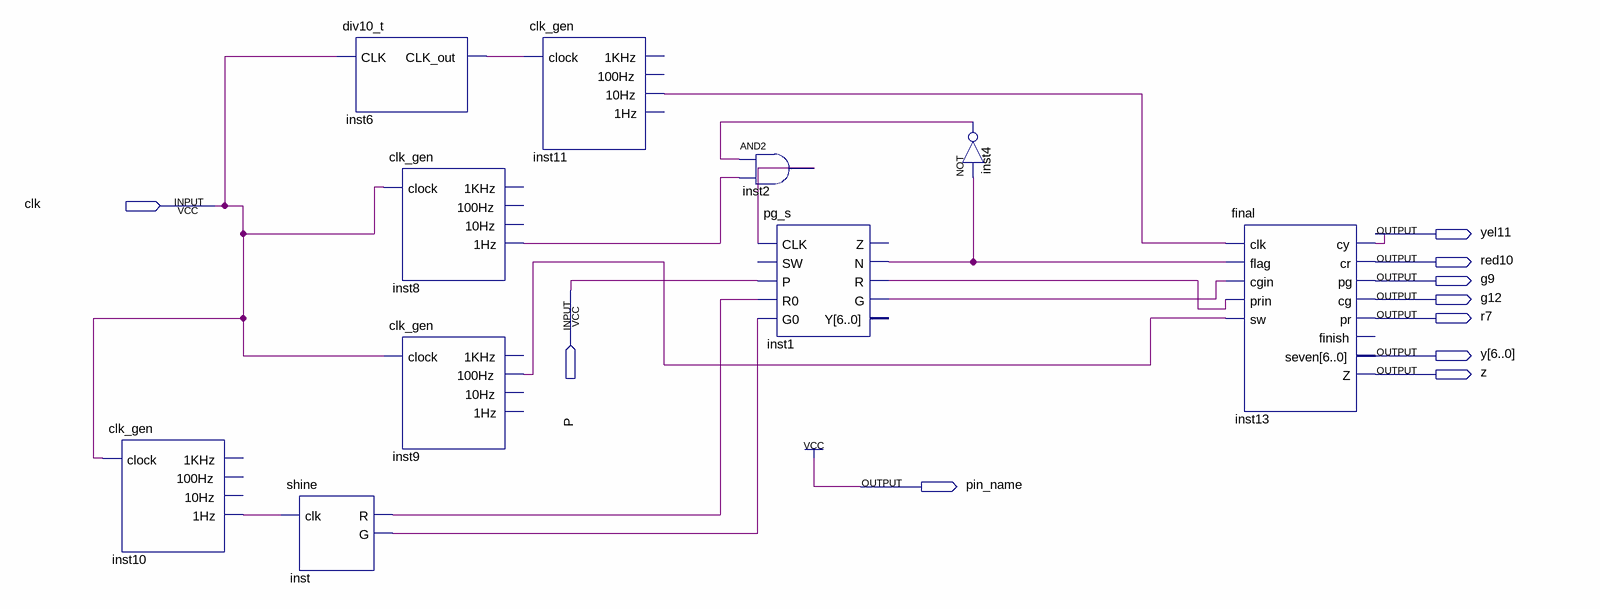
[diagram p0: schematic sheet]
// Quartus schematic fgt.bdf as structural Verilog: 10 symbols, 10 pins
module fgt (
  input  clk,
  input  P,
  output yel11,
  output red10,
  output g9,
  output g12,
  output r7,
  output [6:0] y,
  output z,
  output pin_name
);

  wire inst1_g, inst1_n, inst1_r, inst2_out, inst4_out, inst6_clk_out, inst8_1hz, inst9_100hz, inst10_1hz,
       inst11_10hz, inst_g, inst_r;

  clk_gen inst10 (.clock(clk), .\1Hz (inst10_1hz));  // open: 1KHz, 100Hz, 10Hz
  div10_t inst6 (.CLK(clk), .CLK_out(inst6_clk_out));
  shine inst (.clk(inst10_1hz), .R(inst_r), .G(inst_g));
  clk_gen inst8 (.clock(clk), .\1Hz (inst8_1hz));  // open: 1KHz, 100Hz, 10Hz
  clk_gen inst9 (.clock(clk), .\100Hz (inst9_100hz));  // open: 1KHz, 10Hz, 1Hz
  clk_gen inst11 (.clock(inst6_clk_out), .\10Hz (inst11_10hz));  // open: 1KHz, 100Hz, 1Hz
  and inst2 (inst2_out, inst4_out, inst8_1hz);
  pg_s inst1 (
    .CLK(inst2_out), .P(P), .R0(inst_r), .G0(inst_g), .N(inst1_n), .R(inst1_r), .G(inst1_g));  // open: SW, Z, Y
  not inst4 (inst4_out, inst1_n);
  \final  inst13 (
    .clk(inst11_10hz), .flag(inst1_n), .cgin(inst1_g), .prin(inst1_r), .sw(inst9_100hz), .cy(yel11),
    .cr(red10), .pg(g9), .cg(g12), .pr(r7), .seven(y), .Z(z));  // open: finish

  assign pin_name = 1'b1;
endmodule
